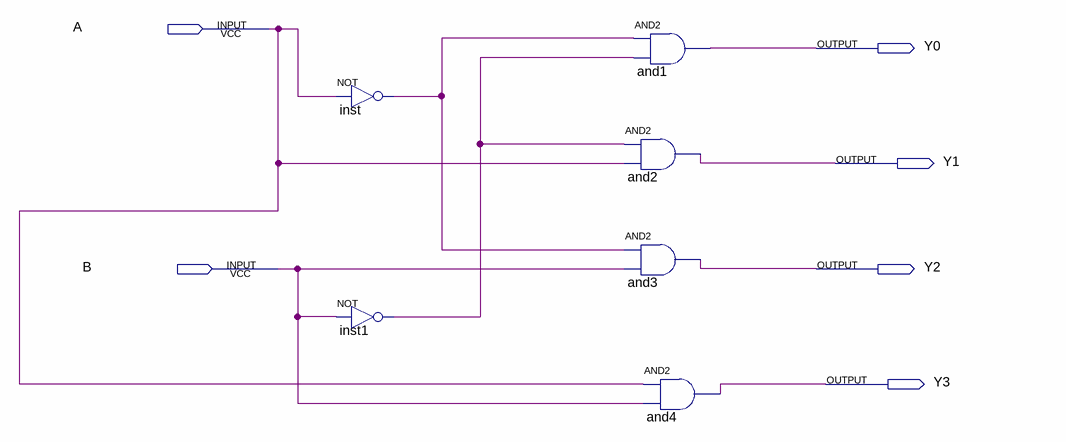
[diagram p0: schematic sheet]
// Quartus schematic dc.bdf as structural Verilog: 6 symbols, 6 pins
module dc (
  input  A,
  input  B,
  output Y0,
  output Y1,
  output Y2,
  output Y3
);

  wire inst1_out, inst_out;

  not inst (inst_out, A);
  not inst1 (inst1_out, B);
  and and1 (Y0, inst_out, inst1_out);
  and and2 (Y1, inst1_out, A);
  and and3 (Y2, inst_out, B);
  and and4 (Y3, A, B);
endmodule
